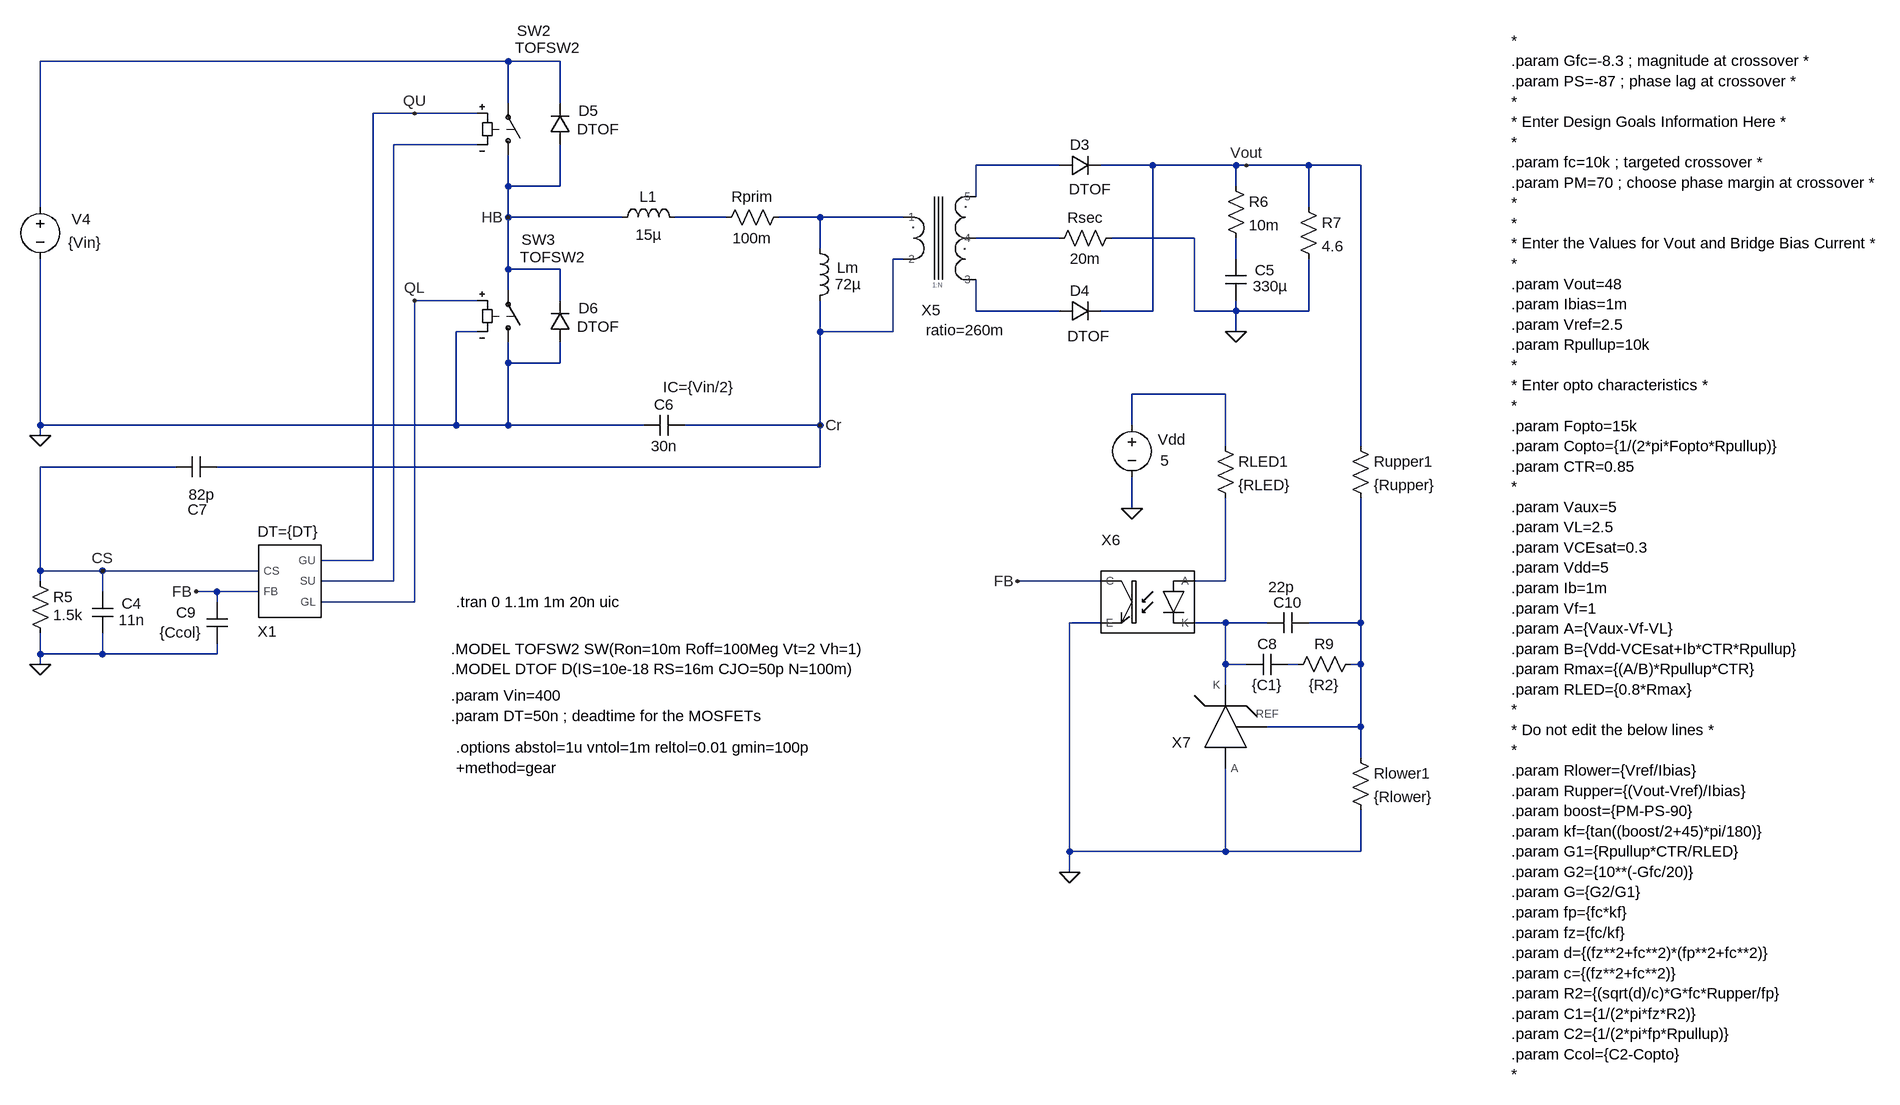
[diagram p0: schematic LLC CM - cbc.asc]
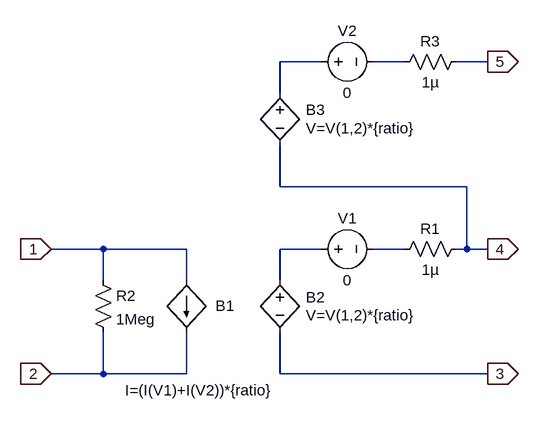
[diagram p1: sub-circuit xfmr_ctap.asc]
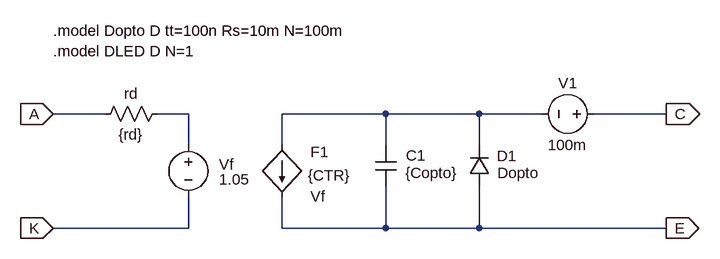
[diagram p2: sub-circuit optotof.asc]
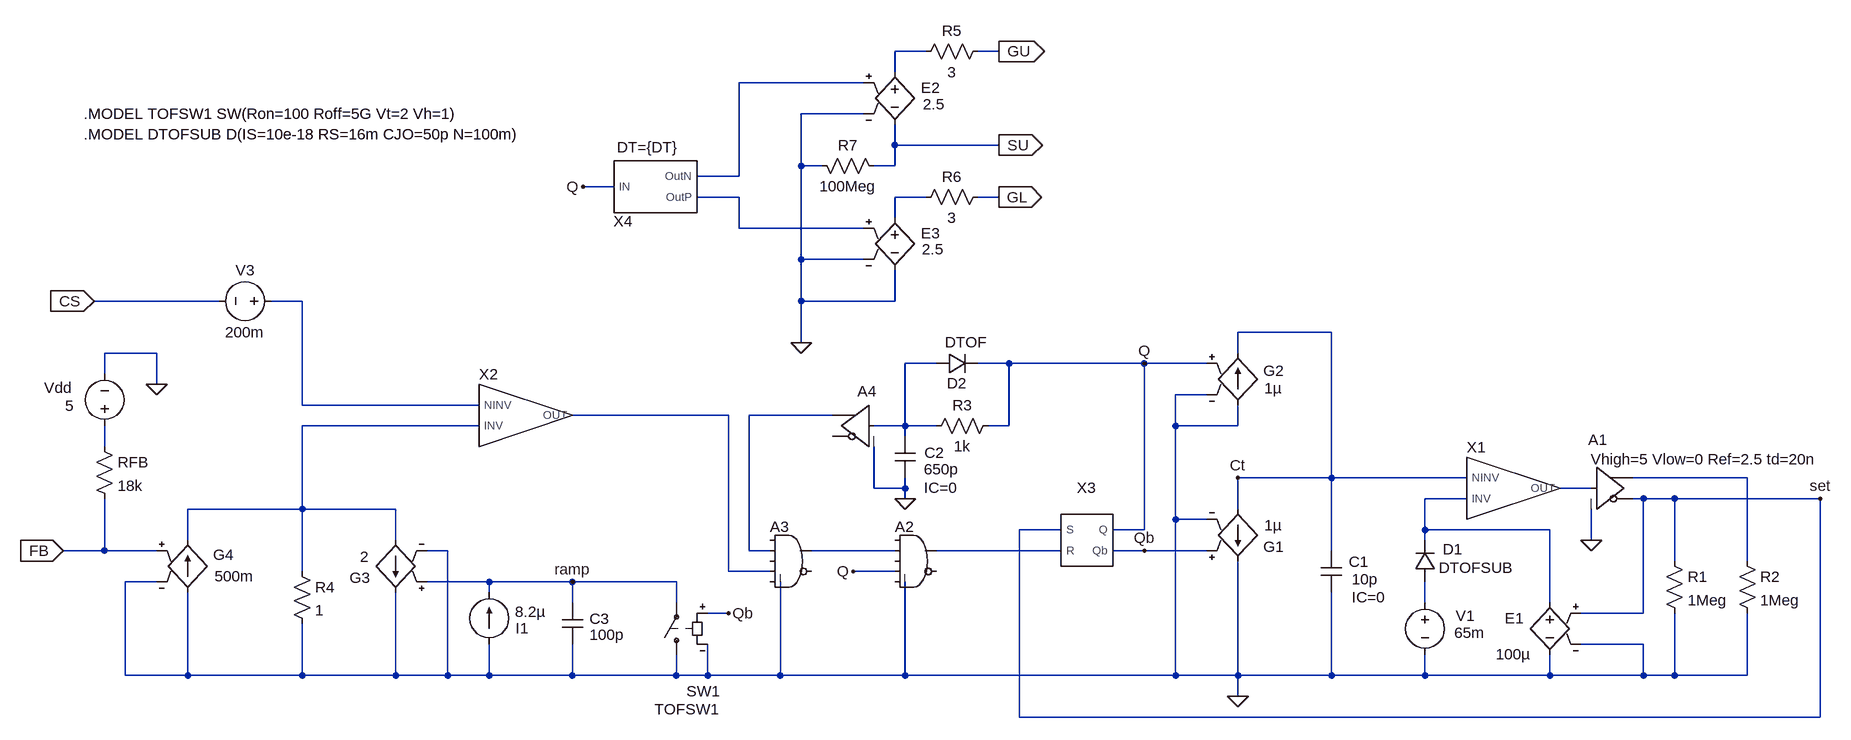
[diagram p3: sub-circuit cm_modulator_subckt.asc]
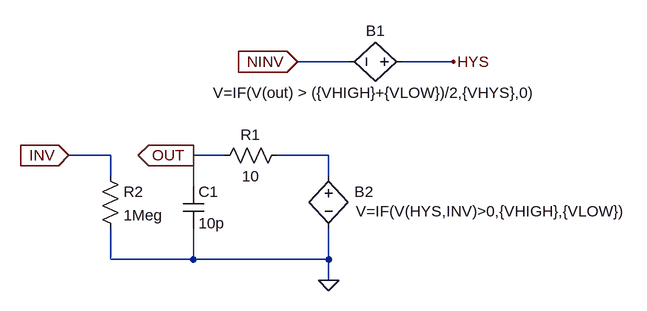
[diagram p4: sub-circuit comptof.asc]
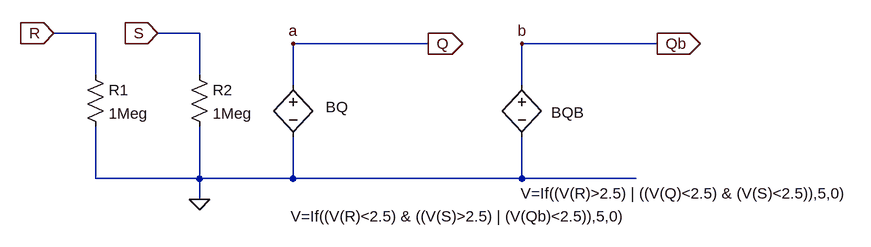
[diagram p5: sub-circuit sr_latch_llc.asc]
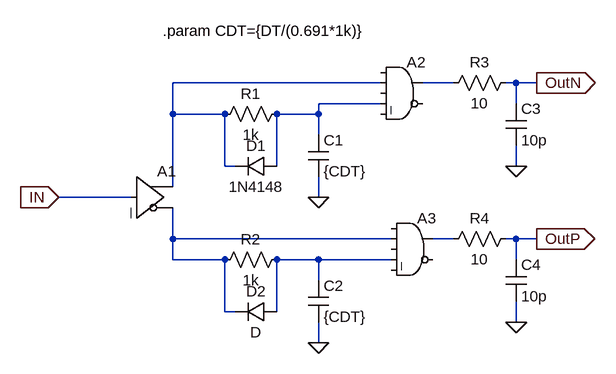
[diagram p6: sub-circuit dt_driver.asc]
LLC CM - cbc.asc, the LTspice schematic file:
Version 4.1
SHEET 1 3260 680
WIRE -1024 -800 -1744 -800
WIRE -944 -800 -1024 -800
WIRE -1024 -736 -1024 -800
WIRE -944 -736 -944 -800
WIRE -1168 -720 -1232 -720
WIRE -1072 -720 -1168 -720
WIRE -1072 -672 -1200 -672
WIRE -176 -640 -304 -640
WIRE -32 -640 -112 -640
WIRE 96 -640 -32 -640
WIRE 112 -640 96 -640
WIRE 208 -640 112 -640
WIRE 288 -640 208 -640
WIRE -1024 -608 -1024 -656
WIRE -944 -608 -944 -672
WIRE -944 -608 -1024 -608
WIRE 96 -608 96 -640
WIRE -304 -592 -304 -640
WIRE -1744 -576 -1744 -800
WIRE 208 -576 208 -640
WIRE -1024 -560 -1024 -608
WIRE -848 -560 -1024 -560
WIRE -688 -560 -768 -560
WIRE -544 -560 -608 -560
WIRE -416 -560 -544 -560
WIRE -176 -528 -304 -528
WIRE 32 -528 -96 -528
WIRE -544 -512 -544 -560
WIRE -416 -496 -432 -496
WIRE 96 -496 96 -528
WIRE -1024 -480 -1024 -560
WIRE -944 -480 -1024 -480
WIRE -1024 -448 -1024 -480
WIRE -1072 -432 -1168 -432
WIRE -944 -432 -944 -480
WIRE -304 -416 -304 -464
WIRE -176 -416 -304 -416
WIRE -32 -416 -32 -640
WIRE -32 -416 -112 -416
WIRE 32 -416 32 -528
WIRE 96 -416 96 -432
WIRE 96 -416 32 -416
WIRE 208 -416 208 -496
WIRE 208 -416 96 -416
WIRE -1072 -384 -1104 -384
WIRE -544 -384 -544 -432
WIRE -432 -384 -432 -496
WIRE -432 -384 -544 -384
WIRE 96 -384 96 -416
WIRE -1024 -336 -1024 -368
WIRE -944 -336 -944 -368
WIRE -944 -336 -1024 -336
WIRE 80 -288 -64 -288
WIRE -1744 -240 -1744 -496
WIRE -1104 -240 -1104 -384
WIRE -1104 -240 -1744 -240
WIRE -1024 -240 -1024 -336
WIRE -1024 -240 -1104 -240
WIRE -816 -240 -1024 -240
WIRE -544 -240 -544 -384
WIRE -544 -240 -752 -240
WIRE -64 -240 -64 -288
WIRE -1744 -224 -1744 -240
WIRE 80 -208 80 -288
WIRE 288 -208 288 -640
WIRE -1536 -176 -1744 -176
WIRE -544 -176 -544 -240
WIRE -544 -176 -1472 -176
WIRE -64 -112 -64 -160
WIRE -1232 -32 -1232 -720
WIRE -1232 -32 -1312 -32
WIRE -1744 -16 -1744 -176
WIRE -1648 -16 -1744 -16
WIRE -1408 -16 -1648 -16
WIRE -1744 0 -1744 -16
WIRE -1200 0 -1200 -672
WIRE -1200 0 -1312 0
WIRE -112 0 -240 0
WIRE 80 0 80 -128
WIRE 80 0 32 0
WIRE -1648 16 -1648 -16
WIRE -1472 16 -1504 16
WIRE -1408 16 -1472 16
WIRE -1472 32 -1472 16
WIRE -1168 32 -1168 -432
WIRE -1168 32 -1312 32
WIRE -112 64 -160 64
WIRE 80 64 32 64
WIRE 144 64 80 64
WIRE 288 64 288 -128
WIRE 288 64 208 64
WIRE -1744 112 -1744 80
WIRE -1648 112 -1648 80
WIRE -1648 112 -1744 112
WIRE -1472 112 -1472 96
WIRE -1472 112 -1648 112
WIRE -1744 128 -1744 112
WIRE 80 128 80 64
WIRE 112 128 80 128
WIRE 192 128 176 128
WIRE 288 128 288 64
WIRE 288 128 272 128
WIRE 80 160 80 128
WIRE 288 224 288 128
WIRE 288 224 144 224
WIRE 288 272 288 224
WIRE -160 416 -160 64
WIRE 80 416 80 288
WIRE 80 416 -160 416
WIRE 288 416 288 352
WIRE 288 416 80 416
WIRE -160 448 -160 416
FLAG -1504 16 FB
FLAG -1744 128 0
FLAG 96 -384 0
FLAG 112 -640 Vout
FLAG -1024 -560 HB
FLAG -1168 -720 QU
FLAG -1168 -432 QL
FLAG -544 -240 Cr
FLAG -1744 -224 0
FLAG -240 0 FB
FLAG -160 448 0
FLAG -1648 -16 CS
FLAG -64 -112 0
SYMBOL cap -1664 16 R0
WINDOW 0 45 18 Left 2
WINDOW 3 41 44 Left 2
SYMATTR InstName C4
SYMATTR Value 11n
SYMBOL res -1760 -16 R0
WINDOW 3 36 68 Left 2
SYMATTR Value 1.5k
SYMATTR InstName R5
SYMBOL diode -176 -624 R270
WINDOW 0 32 32 VTop 2
WINDOW 3 -5 48 VBottom 2
SYMATTR InstName D3
SYMATTR Value DTOF
SYMBOL diode -176 -400 R270
WINDOW 0 32 32 VTop 2
WINDOW 3 -7 46 VBottom 2
SYMATTR InstName D4
SYMATTR Value DTOF
SYMBOL res 80 -624 R0
SYMATTR InstName R6
SYMATTR Value 10m
SYMBOL cap 80 -496 R0
WINDOW 0 45 17 Left 2
WINDOW 3 42 42 Left 2
SYMATTR InstName C5
SYMATTR Value 330µ
SYMBOL res 192 -592 R0
SYMATTR InstName R7
SYMATTR Value 4.6
SYMBOL res -80 -544 R90
WINDOW 0 0 56 VBottom 2
WINDOW 3 32 56 VTop 2
SYMATTR InstName Rsec
SYMATTR Value 20m
SYMBOL ind -560 -528 R0
WINDOW 0 42 45 Left 2
WINDOW 3 39 71 Left 2
SYMATTR InstName Lm
SYMATTR Value 72µ
SYMBOL cap -752 -256 R90
WINDOW 0 0 32 VBottom 2
WINDOW 3 32 32 VTop 2
WINDOW 123 -27 -21 VBottom 2
SYMATTR InstName C6
SYMATTR Value 30n
SYMATTR Value2 IC={Vin/2}
SYMBOL res -592 -576 R90
WINDOW 0 0 56 VBottom 2
WINDOW 3 32 56 VTop 2
SYMATTR InstName Rprim
SYMATTR Value 100m
SYMBOL ind -864 -544 R270
WINDOW 0 32 56 VTop 2
WINDOW 3 5 56 VBottom 2
SYMATTR InstName L1
SYMATTR Value 15µ
SYMBOL sw -1024 -640 M180
WINDOW 3 11 181 Left 2
WINDOW 0 14 207 Left 2
SYMATTR Value TOFSW2
SYMATTR InstName SW2
SYMBOL sw -1024 -352 M180
WINDOW 3 18 147 Left 2
WINDOW 0 21 174 Left 2
SYMATTR Value TOFSW2
SYMATTR InstName SW3
SYMBOL voltage -1744 -592 R0
WINDOW 0 48 35 Left 2
WINDOW 3 43 71 Left 2
SYMATTR InstName V4
SYMATTR Value {Vin}
SYMBOL diode -928 -672 R180
WINDOW 0 -43 52 Left 2
WINDOW 3 -76 24 Left 2
SYMATTR InstName D5
SYMATTR Value DTOF
SYMBOL diode -928 -368 R180
WINDOW 0 -43 52 Left 2
WINDOW 3 -76 24 Left 2
SYMATTR InstName D6
SYMATTR Value DTOF
SYMBOL cap -1472 -192 R90
WINDOW 0 97 30 VBottom 2
WINDOW 3 43 23 VTop 2
SYMATTR InstName C7
SYMATTR Value 82p
SYMBOL XFMR_CTap -352 -544 R0
WINDOW 0 -21 142 Bottom 2
WINDOW 39 32 173 Bottom 2
SYMATTR InstName X5
SYMATTR SpiceLine ratio=260m
SYMBOL res 272 256 R0
SYMATTR InstName Rlower1
SYMATTR Value {Rlower}
SYMBOL res 272 -224 R0
SYMATTR InstName Rupper1
SYMATTR Value {Rupper}
SYMBOL res 64 -224 R0
SYMATTR InstName RLED1
SYMATTR Value {RLED}
SYMBOL cap 176 112 R90
WINDOW 0 0 32 VBottom 2
WINDOW 3 32 32 VTop 2
SYMATTR InstName C8
SYMATTR Value {C1}
SYMBOL cap -1456 32 M0
WINDOW 0 48 16 Left 2
WINDOW 3 40 47 Left 2
SYMATTR InstName C9
SYMATTR Value {Ccol}
SYMBOL res 288 112 R90
WINDOW 0 0 56 VBottom 2
WINDOW 3 32 56 VTop 2
SYMATTR InstName R9
SYMATTR Value {R2}
SYMBOL cap 208 48 R90
WINDOW 0 0 32 VBottom 2
WINDOW 3 -55 42 VTop 2
SYMATTR InstName C10
SYMATTR Value 22p
SYMBOL optoTOF -80 32 M0
WINDOW 0 16 -80 Bottom 2
SYMATTR InstName X6
SYMATTR SpiceLine rd=100 CTR={CTR} Copto={Copto}
SYMBOL TL431TOF 64 176 R0
WINDOW 0 -52 88 Bottom 2
SYMATTR InstName X7
SYMBOL CM_modulator_subckt -1360 0 R0
WINDOW 0 -35 93 Bottom 2
WINDOW 39 -2 -61 Bottom 2
SYMATTR InstName X1
SYMATTR SpiceLine DT={DT}
SYMBOL voltage -64 -256 R0
WINDOW 0 40 38 Left 2
WINDOW 3 44 70 Left 2
SYMATTR InstName Vdd
SYMATTR Value 5
TEXT -1104 32 Left 2 !.tran 0 1.1m 1m 20n uic
TEXT -1112 104 Left 2 !.MODEL TOFSW2 SW(Ron=10m Roff=100Meg Vt=2 Vh=1)\n.MODEL DTOF D(IS=10e-18 RS=16m CJO=50p N=100m)
TEXT -1112 176 Left 2 !.param Vin=400\n.param DT=50n ; deadtime for the MOSFETs
TEXT -1104 256 Left 2 !.options abstol=1u vntol=1m reltol=0.01 gmin=100p\n+method=gear
TEXT 520 -832 Left 2 !*\n.param Gfc=-8.3 ; magnitude at crossover *\n.param PS=-87 ; phase lag at crossover *\n*\n* Enter Design Goals Information Here *\n*\n.param fc=10k ; targeted crossover *\n.param PM=70 ; choose phase margin at crossover *\n*\n*\n* Enter the Values for Vout and Bridge Bias Current *\n*\n.param Vout=48\n.param Ibias=1m\n.param Vref=2.5\n.param Rpullup=10k\n*\n* Enter opto characteristics *\n*\n.param Fopto=15k\n.param Copto={1/(2*pi*Fopto*Rpullup)}\n.param CTR=0.85\n*\n.param Vaux=5\n.param VL=2.5\n.param VCEsat=0.3\n.param Vdd=5\n.param Ib=1m\n.param Vf=1\n.param A={Vaux-Vf-VL}\n.param B={Vdd-VCEsat+Ib*CTR*Rpullup}\n.param Rmax={(A/B)*Rpullup*CTR}\n.param RLED={0.8*Rmax}\n*\n* Do not edit the below lines *\n*\n.param Rlower={Vref/Ibias}\n.param Rupper={(Vout-Vref)/Ibias}\n.param boost={PM-PS-90}\n.param kf={tan((boost/2+45)*pi/180)}\n.param G1={Rpullup*CTR/RLED}\n.param G2={10**(-Gfc/20)}\n.param G={G2/G1}\n.param fp={fc*kf}\n.param fz={fc/kf}\n.param d={(fz**2+fc**2)*(fp**2+fc**2)}\n.param c={(fz**2+fc**2)}\n.param R2={(sqrt(d)/c)*G*fc*Rupper/fp}\n.param C1={1/(2*pi*fz*R2)}\n.param C2={1/(2*pi*fp*Rpullup)}\n.param Ccol={C2-Copto}\n*

xfmr_ctap.asc, the sub-circuit schematic file:
Version 4
SHEET 1 880 680
WIRE 368 -192 304 -192
WIRE 496 -192 448 -192
WIRE 624 -192 576 -192
WIRE 304 -144 304 -192
WIRE 304 0 304 -64
WIRE 592 0 304 0
WIRE 32 96 -48 96
WIRE 160 96 32 96
WIRE 368 96 304 96
WIRE 496 96 448 96
WIRE 592 96 592 0
WIRE 592 96 576 96
WIRE 624 96 592 96
WIRE 32 144 32 96
WIRE 160 144 160 96
WIRE 304 144 304 96
WIRE 32 288 32 224
WIRE 32 288 -48 288
WIRE 160 288 160 224
WIRE 160 288 32 288
WIRE 304 288 304 224
WIRE 624 288 304 288
FLAG 624 96 4
IOPIN 624 96 Out
FLAG 624 288 3
IOPIN 624 288 Out
FLAG -48 96 1
IOPIN -48 96 In
FLAG -48 288 2
IOPIN -48 288 In
FLAG 624 -192 5
IOPIN 624 -192 Out
SYMBOL bi 160 144 R0
WINDOW 0 45 39 Left 2
WINDOW 3 -94 169 Left 2
SYMATTR InstName B1
SYMATTR Value I=(I(V1)+I(V2))*{ratio}
SYMBOL bv 304 128 R0
WINDOW 0 40 42 Left 2
WINDOW 3 40 70 Left 2
SYMATTR InstName B2
SYMATTR Value V=V(1,2)*{ratio}
SYMBOL voltage 352 96 R270
WINDOW 0 32 56 VTop 2
WINDOW 3 -32 56 VBottom 2
WINDOW 123 0 0 Left 0
WINDOW 39 0 0 Left 0
SYMATTR InstName V1
SYMATTR Value 0
SYMBOL res 592 80 R90
WINDOW 0 0 56 VBottom 2
WINDOW 3 32 56 VTop 2
SYMATTR InstName R1
SYMATTR Value 1µ
SYMBOL res 16 128 R0
SYMATTR InstName R2
SYMATTR Value 1Meg
SYMBOL bv 304 -160 R0
WINDOW 0 40 42 Left 2
WINDOW 3 40 70 Left 2
SYMATTR InstName B3
SYMATTR Value V=V(1,2)*{ratio}
SYMBOL voltage 352 -192 R270
WINDOW 0 32 56 VTop 2
WINDOW 3 -32 56 VBottom 2
WINDOW 123 0 0 Left 0
WINDOW 39 0 0 Left 0
SYMATTR InstName V2
SYMATTR Value 0
SYMBOL res 592 -208 R90
WINDOW 0 0 56 VBottom 2
WINDOW 3 32 56 VTop 2
SYMATTR InstName R3
SYMATTR Value 1µ

optotof.asc, the sub-circuit schematic file:
Version 4
SHEET 1 892 680
WIRE -48 32 -128 32
WIRE 80 32 32 32
WIRE 384 32 224 32
WIRE 528 32 384 32
WIRE 624 32 528 32
WIRE 816 32 704 32
WIRE 80 80 80 32
WIRE 224 80 224 32
WIRE 384 80 384 32
WIRE 528 80 528 32
WIRE 80 208 80 160
WIRE 80 208 -128 208
WIRE 224 208 224 160
WIRE 384 208 384 144
WIRE 384 208 224 208
WIRE 528 208 528 144
WIRE 528 208 384 208
WIRE 816 208 528 208
FLAG -128 32 A
IOPIN -128 32 In
FLAG -128 208 K
IOPIN -128 208 In
FLAG 816 32 C
IOPIN 816 32 Out
FLAG 816 208 E
IOPIN 816 208 Out
SYMBOL f 224 80 R0
WINDOW 0 44 11 Left 2
WINDOW 3 40 47 Left 2
WINDOW 38 44 79 Left 2
SYMATTR InstName F1
SYMATTR Value {CTR}
SYMATTR SpiceModel Vf
SYMBOL res 48 16 R90
WINDOW 0 0 56 VBottom 2
WINDOW 3 32 56 VTop 2
SYMATTR InstName rd
SYMATTR Value {rd}
SYMBOL voltage 80 64 R0
WINDOW 0 47 46 Left 2
WINDOW 3 47 69 Left 2
WINDOW 123 0 0 Left 0
WINDOW 39 0 0 Left 0
SYMATTR InstName Vf
SYMATTR Value 1.05
SYMBOL voltage 720 32 R90
WINDOW 0 -32 56 VBottom 2
WINDOW 3 32 56 VTop 2
SYMATTR InstName V1
SYMATTR Value 100m
SYMBOL cap 368 80 R0
WINDOW 0 47 16 Left 2
WINDOW 3 46 43 Left 2
SYMATTR InstName C1
SYMATTR Value {Copto}
SYMBOL diode 512 144 M180
WINDOW 0 43 47 Left 2
WINDOW 3 44 21 Left 2
SYMATTR InstName D1
SYMATTR Value Dopto
TEXT -128 -96 Left 2 !.model Dopto D tt=100n Rs=10m N=100m\n.model DLED D N=1

cm_modulator_subckt.asc, the sub-circuit schematic file:
Version 4
SHEET 1 1496 680
WIRE 80 -576 32 -576
WIRE 192 -576 160 -576
WIRE 32 -544 32 -576
WIRE -16 -528 -208 -528
WIRE -16 -480 -112 -480
WIRE 32 -432 32 -464
WIRE 192 -432 32 -432
WIRE -112 -400 -112 -480
WIRE -80 -400 -112 -400
WIRE 32 -400 32 -432
WIRE 32 -400 0 -400
WIRE -208 -384 -208 -528
WIRE -208 -384 -272 -384
WIRE -400 -368 -448 -368
WIRE -208 -352 -272 -352
WIRE 80 -352 32 -352
WIRE 192 -352 160 -352
WIRE 32 -320 32 -352
WIRE -208 -304 -208 -352
WIRE -16 -304 -208 -304
WIRE -112 -256 -112 -400
WIRE -16 -256 -112 -256
WIRE -1008 -192 -1200 -192
WIRE -880 -192 -928 -192
WIRE -112 -192 -112 -256
WIRE 32 -192 32 -240
WIRE 32 -192 -112 -192
WIRE 704 -144 560 -144
WIRE -112 -128 -112 -192
WIRE -1104 -112 -1184 -112
WIRE 560 -112 560 -144
WIRE 96 -96 48 -96
WIRE 208 -96 160 -96
WIRE 416 -96 208 -96
WIRE 512 -96 416 -96
WIRE -1184 -80 -1184 -112
WIRE -1104 -64 -1104 -112
WIRE 512 -48 464 -48
WIRE -880 -32 -880 -192
WIRE -608 -32 -880 -32
WIRE -224 -16 -464 -16
WIRE -64 -16 -192 -16
WIRE -608 0 -880 0
WIRE 48 0 48 -96
WIRE 48 0 0 0
WIRE 96 0 48 0
WIRE 208 0 208 -96
WIRE 208 0 176 0
WIRE 464 0 464 -48
WIRE 560 0 560 -32
WIRE 560 0 464 0
WIRE 48 16 48 0
WIRE -1184 32 -1184 0
WIRE 704 80 704 -144
WIRE 704 80 560 80
WIRE 912 80 704 80
WIRE 1344 80 1168 80
WIRE 0 96 0 32
WIRE 48 96 48 80
WIRE 48 96 0 96
WIRE 1104 96 1056 96
WIRE 48 112 48 96
WIRE 912 112 848 112
WIRE 1184 112 1168 112
WIRE 1232 112 1184 112
WIRE 1456 112 1232 112
WIRE -880 128 -880 0
WIRE -880 128 -1056 128
WIRE -736 128 -880 128
WIRE 560 128 560 80
WIRE 464 144 464 0
WIRE 512 144 464 144
WIRE 288 160 224 160
WIRE 416 160 416 -96
WIRE 416 160 368 160
WIRE 848 160 848 112
WIRE 1040 160 848 160
WIRE -1056 176 -1056 128
WIRE -736 176 -736 128
WIRE 848 176 848 160
WIRE 1104 176 1104 128
WIRE -1184 192 -1184 112
WIRE -1184 192 -1248 192
WIRE -1104 192 -1184 192
WIRE -656 192 -688 192
WIRE -192 192 -192 -16
WIRE -160 192 -192 192
WIRE 32 192 -96 192
WIRE 288 192 96 192
WIRE 416 192 368 192
WIRE 512 192 416 192
WIRE 704 192 704 80
WIRE 1232 208 1232 112
WIRE 1344 208 1344 80
WIRE -880 224 -880 128
WIRE -224 224 -224 -16
WIRE -160 224 -224 224
WIRE 32 224 -32 224
WIRE -1104 240 -1152 240
WIRE -592 240 -688 240
WIRE -464 240 -592 240
WIRE -304 240 -464 240
WIRE -592 256 -592 240
WIRE -464 272 -464 240
WIRE -304 272 -304 240
WIRE 848 272 848 240
WIRE 1040 272 1040 160
WIRE -224 288 -256 288
WIRE 1184 288 1184 112
WIRE 1184 288 1088 288
WIRE 1184 336 1088 336
WIRE -1152 384 -1152 240
WIRE -1056 384 -1056 256
WIRE -1056 384 -1152 384
WIRE -880 384 -880 304
WIRE -880 384 -1056 384
WIRE -736 384 -736 256
WIRE -736 384 -880 384
WIRE -656 384 -656 192
WIRE -656 384 -736 384
WIRE -592 384 -592 336
WIRE -592 384 -656 384
WIRE -464 384 -464 336
WIRE -464 384 -592 384
WIRE -304 384 -304 352
WIRE -304 384 -464 384
WIRE -256 384 -256 336
WIRE -256 384 -304 384
WIRE -144 384 -144 240
WIRE -144 384 -256 384
WIRE 48 384 48 240
WIRE 48 384 -144 384
WIRE 464 384 464 144
WIRE 464 384 48 384
WIRE 560 384 560 208
WIRE 560 384 464 384
WIRE 704 384 704 256
WIRE 704 384 560 384
WIRE 848 384 848 352
WIRE 848 384 704 384
WIRE 1040 384 1040 352
WIRE 1040 384 848 384
WIRE 1184 384 1184 336
WIRE 1184 384 1040 384
WIRE 1232 384 1232 288
WIRE 1232 384 1184 384
WIRE 1344 384 1344 288
WIRE 1344 384 1232 384
WIRE 560 416 560 384
WIRE 224 448 224 160
WIRE 1456 448 1456 112
WIRE 1456 448 224 448
FLAG 560 416 0
FLAG 560 80 Ct
FLAG 416 -96 Q
FLAG 1456 112 set
FLAG -32 224 Q
FLAG 48 112 0
FLAG 1104 176 0
FLAG 416 192 Qb
FLAG -224 288 Qb
FLAG -1248 192 FB
IOPIN -1248 192 In
FLAG -464 240 ramp
FLAG -1200 -192 CS
IOPIN -1200 -192 In
FLAG -1104 -64 0
FLAG -448 -368 Q
FLAG -112 -128 0
FLAG 192 -432 SU
IOPIN 192 -432 Out
FLAG 192 -576 GU
IOPIN 192 -576 Out
FLAG 192 -352 GL
IOPIN 192 -352 Out
SYMBOL cap 688 192 R0
WINDOW 0 43 17 Left 2
WINDOW 3 47 44 Left 2
WINDOW 123 47 72 Left 2
SYMATTR InstName C1
SYMATTR Value 10p
SYMATTR Value2 IC=0
SYMBOL g 560 224 M180
WINDOW 0 39 38 Left 2
WINDOW 3 41 71 Left 2
SYMATTR InstName G1
SYMATTR Value 1µ
SYMBOL g 560 -128 R0
WINDOW 0 39 43 Left 2
WINDOW 3 41 70 Left 2
SYMATTR InstName G2
SYMATTR Value 1µ
SYMBOL COMPTOF 976 96 M180
WINDOW 0 -49 79 Bottom 2
SYMATTR InstName X1
SYMATTR SpiceLine VHIGH=5 VLOW=100m VHYS=1u
SYMBOL voltage 848 256 R0
WINDOW 0 47 36 Left 2
WINDOW 3 45 62 Left 2
WINDOW 123 0 0 Left 0
WINDOW 39 0 0 Left 0
SYMATTR InstName V1
SYMATTR Value 65m
SYMBOL diode 864 240 R180
WINDOW 0 -42 50 Left 2
WINDOW 3 -120 22 Left 2
SYMATTR InstName D1
SYMATTR Value DTOFSUB
SYMBOL e 1040 256 M0
WINDOW 0 40 40 Left 2
WINDOW 3 29 95 Left 2
SYMATTR InstName E1
SYMATTR Value 100µ
SYMBOL Digital\\buf 1104 32 R0
WINDOW 0 -5 -11 Left 2
WINDOW 39 -1 19 Left 2
SYMATTR InstName A1
SYMATTR SpiceLine Vhigh=5 Vlow=0 Ref=2.5 td=20n
SYMBOL res 1216 192 R0
SYMATTR InstName R1
SYMATTR Value 1Meg
SYMBOL res 1328 192 R0
SYMATTR InstName R2
SYMATTR Value 1Meg
SYMBOL Digital\\and 64 144 R0
WINDOW 0 -32 11 Left 2
SYMATTR InstName A2
SYMATTR SpiceLine Vhigh=5 Vlow=0 Ref=2.5
SYMBOL Digital\\and -128 144 R0
WINDOW 0 -32 11 Left 2
SYMATTR InstName A3
SYMATTR SpiceLine Vhigh=5 Vlow=0 Ref=2.5
SYMBOL Digital\\buf 0 -64 M0
WINDOW 0 -4 11 Left 2
SYMATTR InstName A4
SYMATTR SpiceLine Vhigh=5 Vlow=0 Ref=2.5
SYMBOL res 192 -16 R90
WINDOW 0 0 56 VBottom 2
WINDOW 3 32 56 VTop 2
SYMATTR InstName R3
SYMATTR Value 1k
SYMBOL cap 32 16 R0
WINDOW 0 46 25 Left 2
WINDOW 3 45 51 Left 2
WINDOW 123 45 79 Left 2
SYMATTR InstName C2
SYMATTR Value 650p
SYMATTR Value2 IC=0
SYMBOL diode 96 -80 R270
WINDOW 0 -30 32 VTop 2
WINDOW 3 64 46 VBottom 2
SYMATTR InstName D2
SYMATTR Value DTOF
SYMBOL COMPTOF -544 -16 M180
WINDOW 0 -49 79 Bottom 2
SYMATTR InstName X2
SYMATTR SpiceLine VHIGH=5 VLOW=100m VHYS=100m
SYMBOL sw -304 368 R180
WINDOW 3 -67 -68 Left 2
WINDOW 0 -67 -40 Left 2
SYMATTR Value TOFSW1
SYMATTR InstName SW1
SYMBOL current -592 336 R180
WINDOW 0 -61 25 Left 2
WINDOW 3 -87 50 Left 2
WINDOW 123 0 0 Left 0
WINDOW 39 0 0 Left 0
SYMATTR InstName I1
SYMATTR Value 8.2µ
SYMBOL cap -480 272 R0
WINDOW 0 42 25 Left 2
WINDOW 3 42 49 Left 2
SYMATTR InstName C3
SYMATTR Value 100p
SYMBOL g -736 272 R180
WINDOW 0 39 38 Left 2
WINDOW 3 41 71 Left 2
SYMATTR InstName G3
SYMATTR Value 2
SYMBOL res -896 208 R0
SYMATTR InstName R4
SYMATTR Value 1
SYMBOL g -1056 160 R0
WINDOW 0 39 38 Left 2
WINDOW 3 41 71 Left 2
SYMATTR InstName G4
SYMATTR Value 500m
SYMBOL voltage -912 -192 R90
WINDOW 0 -32 56 VBottom 2
WINDOW 3 32 56 VTop 2
SYMATTR InstName V3
SYMATTR Value 200m
SYMBOL SR_latch_LLC 320 176 R0
SYMATTR InstName X3
SYMBOL res -1200 16 R0
SYMATTR InstName RFB
SYMATTR Value 18k
SYMBOL voltage -1184 16 R180
WINDOW 0 50 75 Left 2
WINDOW 3 47 47 Left 2
SYMATTR InstName Vdd
SYMATTR Value 5
SYMBOL DT_driver -336 -368 R0
WINDOW 39 -12 -45 Bottom 2
WINDOW 0 -50 69 Bottom 2
SYMATTR SpiceLine DT={DT}
SYMATTR InstName X4
SYMBOL e 32 -560 R0
WINDOW 0 40 40 Left 2
WINDOW 3 43 65 Left 2
SYMATTR InstName E2
SYMATTR Value 2.5
SYMBOL e 32 -336 R0
WINDOW 0 40 40 Left 2
WINDOW 3 42 64 Left 2
SYMATTR InstName E3
SYMATTR Value 2.5
SYMBOL res 176 -592 R90
WINDOW 0 0 56 VBottom 2
WINDOW 3 32 56 VTop 2
SYMATTR InstName R5
SYMATTR Value 3
SYMBOL res 176 -368 R90
WINDOW 0 0 56 VBottom 2
WINDOW 3 32 56 VTop 2
SYMATTR InstName R6
SYMATTR Value 3
SYMBOL res -96 -416 M90
WINDOW 0 0 56 VBottom 2
WINDOW 3 32 56 VTop 2
SYMATTR InstName R7
SYMATTR Value 100Meg
TEXT -1216 -480 Left 2 !.MODEL TOFSW1 SW(Ron=100 Roff=5G Vt=2 Vh=1)\n.MODEL DTOFSUB D(IS=10e-18 RS=16m CJO=50p N=100m)

comptof.asc, the sub-circuit schematic file:
Version 4
SHEET 1 880 680
WIRE 64 192 -16 192
WIRE 224 192 144 192
WIRE -304 336 -368 336
WIRE -128 336 -176 336
WIRE 32 336 -48 336
WIRE -304 368 -304 336
WIRE 32 368 32 336
WIRE -176 384 -176 336
WIRE -304 496 -304 448
WIRE -176 496 -176 448
WIRE -176 496 -304 496
WIRE 32 496 32 448
WIRE 32 496 -176 496
WIRE 32 528 32 496
FLAG -16 192 NINV
IOPIN -16 192 In
FLAG 224 192 HYS
FLAG 32 528 0
FLAG -176 336 OUT
IOPIN -176 336 Out
FLAG -368 336 INV
IOPIN -368 336 In
SYMBOL bv 160 192 R90
WINDOW 0 -32 56 VBottom 2
WINDOW 3 32 56 VTop 2
SYMATTR InstName B1
SYMATTR Value V=IF(V(out) > ({VHIGH}+{VLOW})/2,{VHYS},0)
SYMBOL bv 32 352 R0
WINDOW 0 40 40 Left 2
WINDOW 3 42 70 Left 2
SYMATTR InstName B2
SYMATTR Value V=IF(V(HYS,INV)>0,{VHIGH},{VLOW})
SYMBOL res -32 320 R90
WINDOW 0 0 56 VBottom 2
WINDOW 3 32 56 VTop 2
SYMATTR InstName R1
SYMATTR Value 10
SYMBOL cap -192 384 R0
SYMATTR InstName C1
SYMATTR Value 10p
SYMBOL res -320 352 R0
SYMATTR InstName R2
SYMATTR Value 1Meg

sr_latch_llc.asc, the sub-circuit schematic file:
Version 4
SHEET 1 1112 680
WIRE -192 48 -256 48
WIRE -32 48 -96 48
WIRE 320 64 112 64
WIRE 672 64 464 64
WIRE -192 112 -192 48
WIRE -32 112 -32 48
WIRE 112 128 112 64
WIRE 464 128 464 64
WIRE -192 272 -192 192
WIRE -32 272 -32 192
WIRE -32 272 -192 272
WIRE 112 272 112 208
WIRE 112 272 -32 272
WIRE 464 272 464 208
WIRE 464 272 112 272
WIRE 640 272 464 272
WIRE -32 304 -32 272
FLAG -256 48 R
IOPIN -256 48 In
FLAG -96 48 S
IOPIN -96 48 In
FLAG 320 64 Q
IOPIN 320 64 Out
FLAG -32 304 0
FLAG 672 64 Qb
IOPIN 672 64 Out
FLAG 112 64 a
FLAG 464 64 b
SYMBOL bv 112 112 R0
WINDOW 0 50 50 Left 2
WINDOW 3 -4 218 Left 2
SYMATTR InstName BQ
SYMATTR Value V=If((V(R)<2.5) & ((V(S)>2.5) | (V(Qb)<2.5)),5,0)
SYMBOL res -208 96 R0
SYMATTR InstName R1
SYMATTR Value 1Meg
SYMBOL res -48 96 R0
SYMATTR InstName R2
SYMATTR Value 1Meg
SYMBOL bv 464 112 R0
WINDOW 0 45 58 Left 2
WINDOW 3 -2 183 Left 2
SYMATTR InstName BQB
SYMATTR Value V=If((V(R)>2.5) | ((V(Q)<2.5) & (V(S)<2.5)),5,0)

dt_driver.asc, the sub-circuit schematic file:
Version 4
SHEET 1 880 680
WIRE 480 32 160 32
WIRE 592 32 544 32
WIRE 688 32 672 32
WIRE 720 32 688 32
WIRE 480 64 384 64
WIRE 688 64 688 32
WIRE 160 80 160 32
WIRE 240 80 160 80
WIRE 384 80 384 64
WIRE 384 80 320 80
WIRE 384 112 384 80
WIRE 240 160 240 80
WIRE 256 160 240 160
WIRE 320 160 320 80
WIRE 688 160 688 128
WIRE 160 192 160 80
WIRE 96 208 -16 208
WIRE 384 208 384 176
WIRE 160 272 160 224
WIRE 496 272 160 272
WIRE 592 272 560 272
WIRE 688 272 672 272
WIRE 720 272 688 272
WIRE 160 304 160 272
WIRE 240 304 160 304
WIRE 384 304 320 304
WIRE 496 304 384 304
WIRE 688 304 688 272
WIRE 384 336 384 304
WIRE 240 384 240 304
WIRE 256 384 240 384
WIRE 320 384 320 304
WIRE 688 400 688 368
WIRE 384 432 384 400
FLAG 384 208 0
FLAG 384 432 0
FLAG 720 32 OutN
IOPIN 720 32 Out
FLAG 720 272 OutP
IOPIN 720 272 Out
FLAG -16 208 IN
IOPIN -16 208 In
FLAG 688 160 0
FLAG 688 400 0
SYMBOL Digital\\buf 96 144 R0
SYMATTR InstName A1
SYMATTR SpiceLine Vhigh=5 Vlow=0 Ref=1.0
SYMBOL res 336 64 R90
WINDOW 0 0 56 VBottom 2
WINDOW 3 32 56 VTop 2
SYMATTR InstName R1
SYMATTR Value 1k
SYMBOL cap 368 112 R0
SYMATTR InstName C1
SYMATTR Value {CDT}
SYMBOL res 336 288 R90
WINDOW 0 0 56 VBottom 2
WINDOW 3 32 56 VTop 2
SYMATTR InstName R2
SYMATTR Value 1k
SYMBOL cap 368 336 R0
SYMATTR InstName C2
SYMATTR Value {CDT}
SYMBOL Digital\\and 512 -16 R0
SYMATTR InstName A2
SYMATTR SpiceLine Vhigh=5 Vlow=0 Ref=2.5
SYMBOL Digital\\and 528 224 R0
SYMATTR InstName A3
SYMATTR SpiceLine Vhigh=5 Vlow=0 Ref=2.5
SYMBOL diode 320 144 R90
WINDOW 0 0 32 VBottom 2
WINDOW 3 32 32 VTop 2
SYMATTR InstName D1
SYMATTR Value 1N4148
SYMBOL diode 320 368 R90
WINDOW 0 0 32 VBottom 2
WINDOW 3 32 32 VTop 2
SYMATTR InstName D2
SYMBOL res 688 16 R90
WINDOW 0 0 56 VBottom 2
WINDOW 3 32 56 VTop 2
SYMATTR InstName R3
SYMATTR Value 10
SYMBOL res 688 256 R90
WINDOW 0 0 56 VBottom 2
WINDOW 3 32 56 VTop 2
SYMATTR InstName R4
SYMATTR Value 10
SYMBOL cap 672 64 R0
SYMATTR InstName C3
SYMATTR Value 10p
SYMBOL cap 672 304 R0
SYMATTR InstName C4
SYMATTR Value 10p
TEXT 144 -48 Left 2 !.param CDT={DT/(0.691*1k)}

The netlist it stands for:
* LLC CM - cbc.asc
C4 CS 0 11n
R5 CS 0 1.5k
D3 N003 Vout DTOF
D4 N008 Vout DTOF
R6 Vout N007 10m
C5 N007 0 330µ
R7 Vout 0 4.6
Rsec 0 N006 20m
Lm N005 Cr 72µ
C6 Cr 0 30n IC={Vin/2}
Rprim N005 N004 100m
L1 HB N004 15µ
SW2 HB N001 QU N002 TOFSW2
SW3 0 HB QL 0 TOFSW2
V4 N001 0 {Vin}
D5 HB N001 DTOF
D6 0 HB DTOF
C7 Cr CS 82p
X§X5 N005 Cr N008 N006 N003 xfmr_ctap params: ratio=260m
Rlower1 N012 0 {Rlower}
Rupper1 Vout N012 {Rupper}
RLED1 N009 N010 {RLED}
C8 N013 N011 {C1}
C9 FB 0 {Ccol}
R9 N012 N013 {R2}
C10 N012 N011 22p
X§X6 N010 N011 FB 0 optotof params: rd=100 CTR={CTR} Copto={Copto}
X§X7 0 N012 N011 TL431TOF  ; pins A REF K
X§X1 CS FB QL QU N002 cm_modulator_subckt params: DT={DT}
Vdd N009 0 5

* block symbol definitions
.subckt xfmr_ctap 1 2 3 4 5
B1 1 2 I=(I(V1)+I(V2))*{ratio}
B2 N003 3 V=V(1,2)*{ratio}
V1 N003 N004 0
R1 4 N004 1µ
R2 1 2 1Meg
B3 N001 4 V=V(1,2)*{ratio}
V2 N001 N002 0
R3 5 N002 1µ
.ends xfmr_ctap

.subckt optotof A K C E
F1 N002 E Vf {CTR}
rd N001 A {rd}
Vf N001 K 1.05
V1 C N002 100m
C1 N002 E {Copto}
D1 E N002 Dopto
.model Dopto D tt=100n Rs=10m N=100m
.model DLED D N=1
.ends optotof

.subckt cm_modulator_subckt CS FB GL GU SU
C1 Ct 0 10p IC=0
G1 Ct 0 Qb 0 1µ
G2 0 Ct Q 0 1µ
XX1 N013 Ct N012 comptof params: VHIGH=5 VLOW=100m VHYS=1u
V1 N016 0 65m
D1 N016 N013 DTOFSUB
E1 N013 0 set 0 100µ
A1 N012 0 0 0 0 set N011 0 BUF Vhigh=5 Vlow=0 Ref=2.5 td=20n
R1 set 0 1Meg
R2 N011 0 1Meg
A2 0 N014 0 Q 0 0 N015 0 AND Vhigh=5 Vlow=0 Ref=2.5
A3 0 N008 0 N007 0 0 N014 0 AND Vhigh=5 Vlow=0 Ref=2.5
A4 N006 0 0 0 0 0 N008 0 BUF Vhigh=5 Vlow=0 Ref=2.5
R3 Q N006 1k
C2 N006 0 650p IC=0
D2 N006 Q DTOF
XX2 N009 N005 N007 comptof params: VHIGH=5 VLOW=100m VHYS=100m
SW1 0 ramp Qb 0 TOFSW1
I1 0 ramp 8.2µ
C3 ramp 0 100p
G3 N009 0 ramp 0 2
R4 N009 0 1
G4 0 N009 FB 0 500m
V3 N005 CS 200m
XX3 N015 set Q Qb sr_latch_llc
RFB N010 FB 18k
Vdd N010 0 5
XX4 Q N002 N003 dt_driver params: DT={DT}
E2 N001 SU N002 0 2.5
E3 N004 0 N003 0 2.5
R5 GU N001 3
R6 GL N004 3
R7 0 SU 100Meg
.MODEL TOFSW1 SW(Ron=100 Roff=5G Vt=2 Vh=1)
.MODEL DTOFSUB D(IS=10e-18 RS=16m CJO=50p N=100m)
.ends cm_modulator_subckt

.subckt comptof INV NINV OUT
B1 HYS NINV V=IF(V(out) > ({VHIGH}+{VLOW})/2,{VHYS},0)
B2 N001 0 V=IF(V(HYS,INV)>0,{VHIGH},{VLOW})
R1 N001 OUT 10
C1 OUT 0 10p
R2 INV 0 1Meg
.ends comptof

.subckt sr_latch_llc R S Q Qb
BQ Q 0 V=If((V(R)<2.5) & ((V(S)>2.5) | (V(Qb)<2.5)),5,0)
R1 R 0 1Meg
R2 S 0 1Meg
BQB Qb 0 V=If((V(R)>2.5) | ((V(Q)<2.5) & (V(S)<2.5)),5,0)
.ends sr_latch_llc

.subckt dt_driver IN OutN OutP
A1 IN 0 0 0 0 N004 N001 0 BUF Vhigh=5 Vlow=0 Ref=1.0
R1 N003 N001 1k
C1 N003 0 {CDT}
R2 N006 N004 1k
C2 N006 0 {CDT}
A2 0 N001 0 N003 0 0 N002 0 AND Vhigh=5 Vlow=0 Ref=2.5
A3 0 N004 0 N006 0 0 N005 0 AND Vhigh=5 Vlow=0 Ref=2.5
D1 N003 N001 1N4148
D2 N006 N004 D
R3 OutN N002 10
R4 OutP N005 10
C3 OutN 0 10p
C4 OutP 0 10p
.param CDT={DT/(0.691*1k)}
.ends dt_driver

.model D D
.lib standard.dio
.tran 0 1.1m 1m 20n uic
.MODEL TOFSW2 SW(Ron=10m Roff=100Meg Vt=2 Vh=1)
.MODEL DTOF D(IS=10e-18 RS=16m CJO=50p N=100m)
.param Vin=400
.param DT=50n ; deadtime for the MOSFETs
.options abstol=1u vntol=1m reltol=0.01 gmin=100p
+method=gear
*
.param Gfc=-8.3 ; magnitude at crossover *
.param PS=-87 ; phase lag at crossover *
*
* Enter Design Goals Information Here *
*
.param fc=10k ; targeted crossover *
.param PM=70 ; choose phase margin at crossover *
*
*
* Enter the Values for Vout and Bridge Bias Current *
*
.param Vout=48
.param Ibias=1m
.param Vref=2.5
.param Rpullup=10k
*
* Enter opto characteristics *
*
.param Fopto=15k
.param Copto={1/(2*pi*Fopto*Rpullup)}
.param CTR=0.85
*
.param Vaux=5
.param VL=2.5
.param VCEsat=0.3
.param Vdd=5
.param Ib=1m
.param Vf=1
.param A={Vaux-Vf-VL}
.param B={Vdd-VCEsat+Ib*CTR*Rpullup}
.param Rmax={(A/B)*Rpullup*CTR}
.param RLED={0.8*Rmax}
*
* Do not edit the below lines *
*
.param Rlower={Vref/Ibias}
.param Rupper={(Vout-Vref)/Ibias}
.param boost={PM-PS-90}
.param kf={tan((boost/2+45)*pi/180)}
.param G1={Rpullup*CTR/RLED}
.param G2={10**(-Gfc/20)}
.param G={G2/G1}
.param fp={fc*kf}
.param fz={fc/kf}
.param d={(fz**2+fc**2)*(fp**2+fc**2)}
.param c={(fz**2+fc**2)}
.param R2={(sqrt(d)/c)*G*fc*Rupper/fp}
.param C1={1/(2*pi*fz*R2)}
.param C2={1/(2*pi*fp*Rpullup)}
.param Ccol={C2-Copto}
*
.backanno
.end